# EAGLE design Main_PCB (EAGLE 9.6.2)
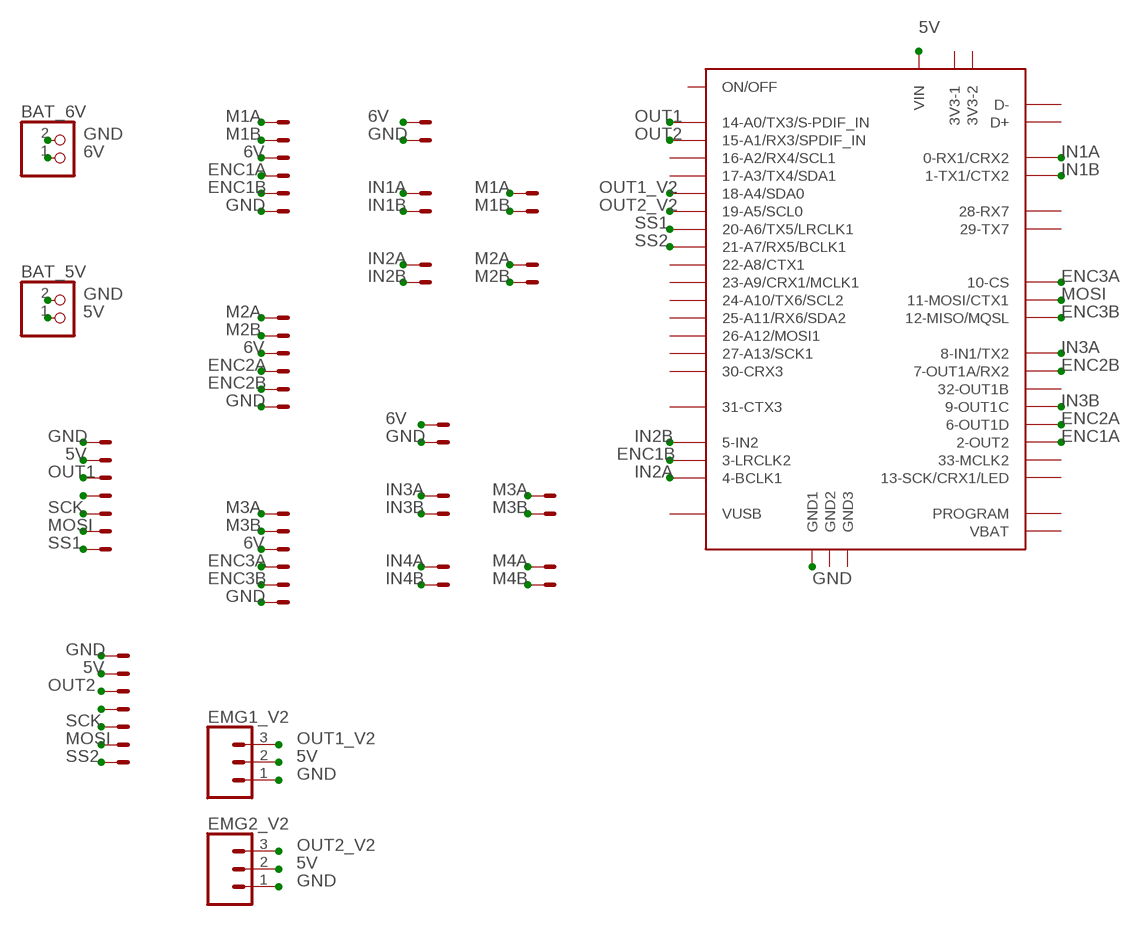
[diagram p0: schematic, sheet 1]

## Parts
BAT_5V  JST_2PIN-THM  [JST-PH-2-THM]
BAT_6V  JST_2PIN-THM  [JST-PH-2-THM]
EMG1  53047-07  [53047-07]
EMG1_V2  CONN_03  [1X03]
EMG2  53047-07  [53047-07]
EMG2_V2  CONN_03  [1X03]
JST-M1  22-23-2061  [22-23-2061]
JST-M2  22-23-2061  [22-23-2061]
JST-M3  22-23-2061  [22-23-2061]
MD1-IN1  22-23-2021  [22-23-2021]
MD1-IN2  22-23-2021  [22-23-2021]
MD1-M1  22-23-2021  [22-23-2021]
MD1-M2  22-23-2021  [22-23-2021]
MD1-PWR  22-23-2021  [22-23-2021]
MD2-IN3  22-23-2021  [22-23-2021]
MD2-IN4  22-23-2021  [22-23-2021]
MD2-M3  22-23-2021  [22-23-2021]
MD2-M4  22-23-2021  [22-23-2021]
MD2-PWR  22-23-2021  [22-23-2021]
U$1  TEENSY40  [TEENSY40]

## Nets
5V: BAT_5V.1 EMG1.2 EMG1_V2.2 EMG2.2 EMG2_V2.2 U$1.VIN
6V: BAT_6V.1 JST-M1.3 JST-M2.3 JST-M3.3 MD1-PWR.1 MD2-PWR.1
ENC1A: JST-M1.4 U$1.2-OUT2
ENC1B: JST-M1.5 U$1.3-LRCLK2
ENC2A: JST-M2.4 U$1.6-OUT1D
ENC2B: JST-M2.5 U$1.7-RX2/OUT1A(7-OUT1A/RX2)
ENC3A: JST-M3.4 U$1.10-CS/MQSR(10-CS)
ENC3B: JST-M3.5 U$1.12-MIO/MQSL(12-MISO/MQSL)
GND: BAT_5V.2 BAT_6V.2 EMG1.1 EMG1_V2.1 EMG2.1 EMG2_V2.1 JST-M1.6 JST-M2.6 JST-M3.6 MD1-PWR.2 MD2-PWR.2 U$1.GND1
IN1A: MD1-IN1.1 U$1.0-RX1(0-RX1/CRX2)
IN1B: MD1-IN1.2 U$1.1-TX1(1-TX1/CTX2)
IN2A: MD1-IN2.1 U$1.4-BCLK2(4-BCLK1)
IN2B: MD1-IN2.2 U$1.5-IN2
IN3A: MD2-IN3.1 U$1.8-TX2/IN1(8-IN1/TX2)
IN3B: MD2-IN3.2 U$1.9-OUT1C
IN4A: MD2-IN4.1
IN4B: MD2-IN4.2
M1A: JST-M1.1 MD1-M1.1
M1B: JST-M1.2 MD1-M1.2
M2A: JST-M2.1 MD1-M2.1
M2B: JST-M2.2 MD1-M2.2
M3A: JST-M3.1 MD2-M3.1
M3B: JST-M3.2 MD2-M3.2
M4A: MD2-M4.1
M4B: MD2-M4.2
MOSI: EMG1.6 EMG2.6 U$1.11-MOSI/CTX1
N$4: EMG1.4
N$11: EMG2.4
OUT1: EMG1.3 U$1.14-A0/TX3/S-PFI_OUT(14-A0/TX3/S-PDIF_IN)
OUT1_V2: EMG1_V2.3 U$1.18-A4/SDA0
OUT2: EMG2.3 U$1.15-A1/RX3/S-PDIF_IN(15-A1/RX3/SPDIF_IN)
OUT2_V2: EMG2_V2.3 U$1.19-A5/SCL0
SCK: EMG1.5 EMG2.5
SS1: EMG1.7 U$1.20-A6/TX5/LRCLK1
SS2: EMG2.7 U$1.21-A7/RX5/BCLK1
Unconnected: U$1.3V3-1 U$1.3V3-2 U$1.13-SCK/CRX1/LED U$1.16-A2/RX4/SCL1 U$1.17-A3/TX4/SDA1 U$1.22-A8/CTX1 U$1.23-A9/CRX1/CCLK1(23-A9/CRX1/MCLK1) U$1.24-A10/TX6/SCL2 U$1.25-A11/SDA2(25-A11/RX6/SDA2) U$1.26-A12/MOSI1 U$1.27-A13/SCK1 U$1.28-RX7 U$1.29-TX7 U$1.30-CRX3 U$1.31-CTX3 U$1.32-OUTB1(32-OUT1B) U$1.33-MCLK2 U$1.D+ U$1.D- U$1.GND2 U$1.GND3 U$1.ON/OFF U$1.PROGRAM U$1.VBAT U$1.VUSB

## Library data of the parts
BAT_5V BAT_6V = adafruit:JST_2PIN: JST 2-Pin Connectors of various flavors SMT-RA (S2B-PH-SM4) 4UConnector #17311 SMT (B2B-PH-SM4) THM-RA (S2B-PH) THM (B2B-PH)
EMG1 EMG2 = con-molex:53?-07: CONNECTOR wire to board 1.25 mm (.049 inch) pitch header; MF: MOLEX; MPN: 53047-0710-C; OC_FARNELL: 9732870; OC_NEWARK: 11M0149
EMG1_V2 EMG2_V2 = SparkFun-Connectors:CONN_03: Multi connection point. Often used as Generic Header-pin footprint for 0.1 inch spaced/style header connections On any of the 0.1 inch spaced packages, you can populate with these: Break Away Headers - Straight <https://www.sparkfun.com/products/116> (PRT-00116) Break Away Male Headers - Right Angle <https://www.sparkfun.com/products/553> (PRT-00553) Female Headers <https://www.sparkfun.com/products/115> (PRT-00115) Break Away Headers - Machine Pin <https://www.sparkfun.com/products/117> (PRT-00117) Break Away Female Headers - Swiss Machine Pin <https://www.sparkfun.com/products/743> (PRT-00743) Stackable Header - 3 Pin (Female, 0.1") <https://www.sparkfun.com/products/13875> (PRT-13875) For SCREWTERMINALS and SPRING TERMINALS visit here: Screw Terimnals on SparkFun.com <https://www.sparkfun.com/search/results?term=Screw+Terminals> (5mm/3.5mm/2.54mm spacing) This device is also useful as a general connection point to wire up your design to another part of your project. Our various solder wires solder well into these plated through hole pads. Hook-Up Wire - Assortment (Stranded, 22 AWG) <https://www.sparkfun.com/products/11375> (PRT-11375) Hook-Up Wire - Assortment (Solid Core, 22 AWG) <https://www.sparkfun.com/products/11367> (PRT-11367) View the entire wire category on our website here <https://www.sparkfun.com/categories/141> Special notes: Molex polarized connector foot print use with SKU : PRT-08232 with associated crimp pins and housings.
JST-M1-JST-M3 = con-molex:22-23-2061: .100" (2.54mm) Center Header - 6 Pin; MF: MOLEX; MPN: 22-23-2061; OC_FARNELL: 1462922; OC_NEWARK: 27C1933
MD1-IN1 MD1-IN2 MD1-M1 MD1-M2 MD1-PWR MD2-IN3 MD2-IN4 MD2-M3 MD2-M4 MD2-PWR = con-molex:22-23-2021: .100" (2.54mm) Center Header - 2 Pin; MF: MOLEX; MPN: 22-23-2021; OC_FARNELL: 1462926; OC_NEWARK: 25C3832
U$1 = teensy:TEENSY40: Teensy 4.0 device including POGO pins for pins 24 - 33, but not yet pins for D+ and D-. Symbol layout is what works for me and may not suite everyone... that can be added or additional symbols can be created to be used in a modilied davie name.

## Board
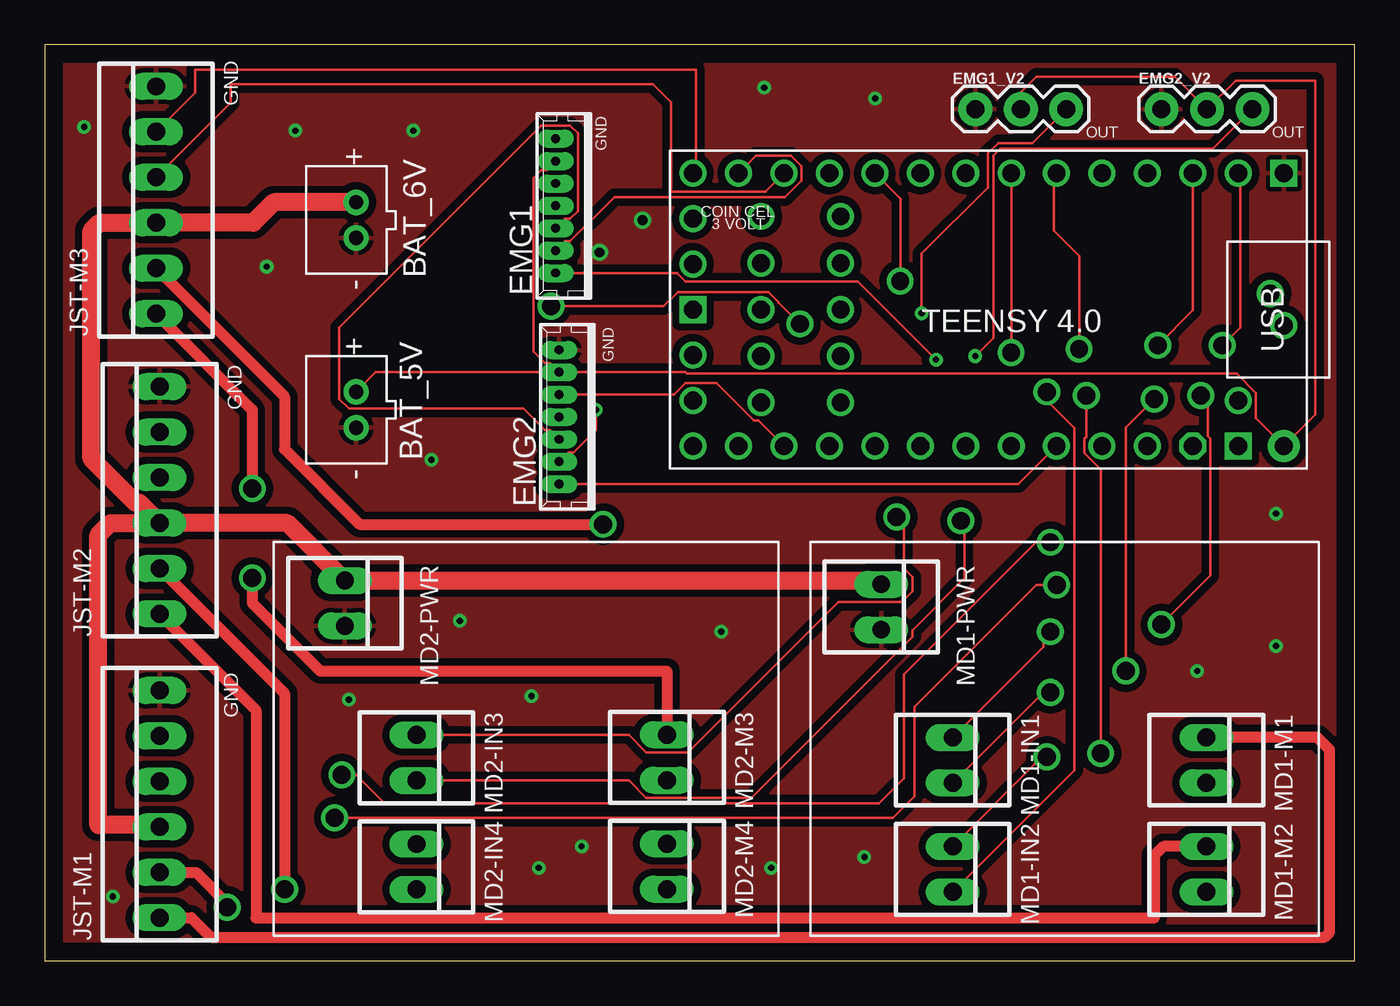
[diagram p1: board, top side]
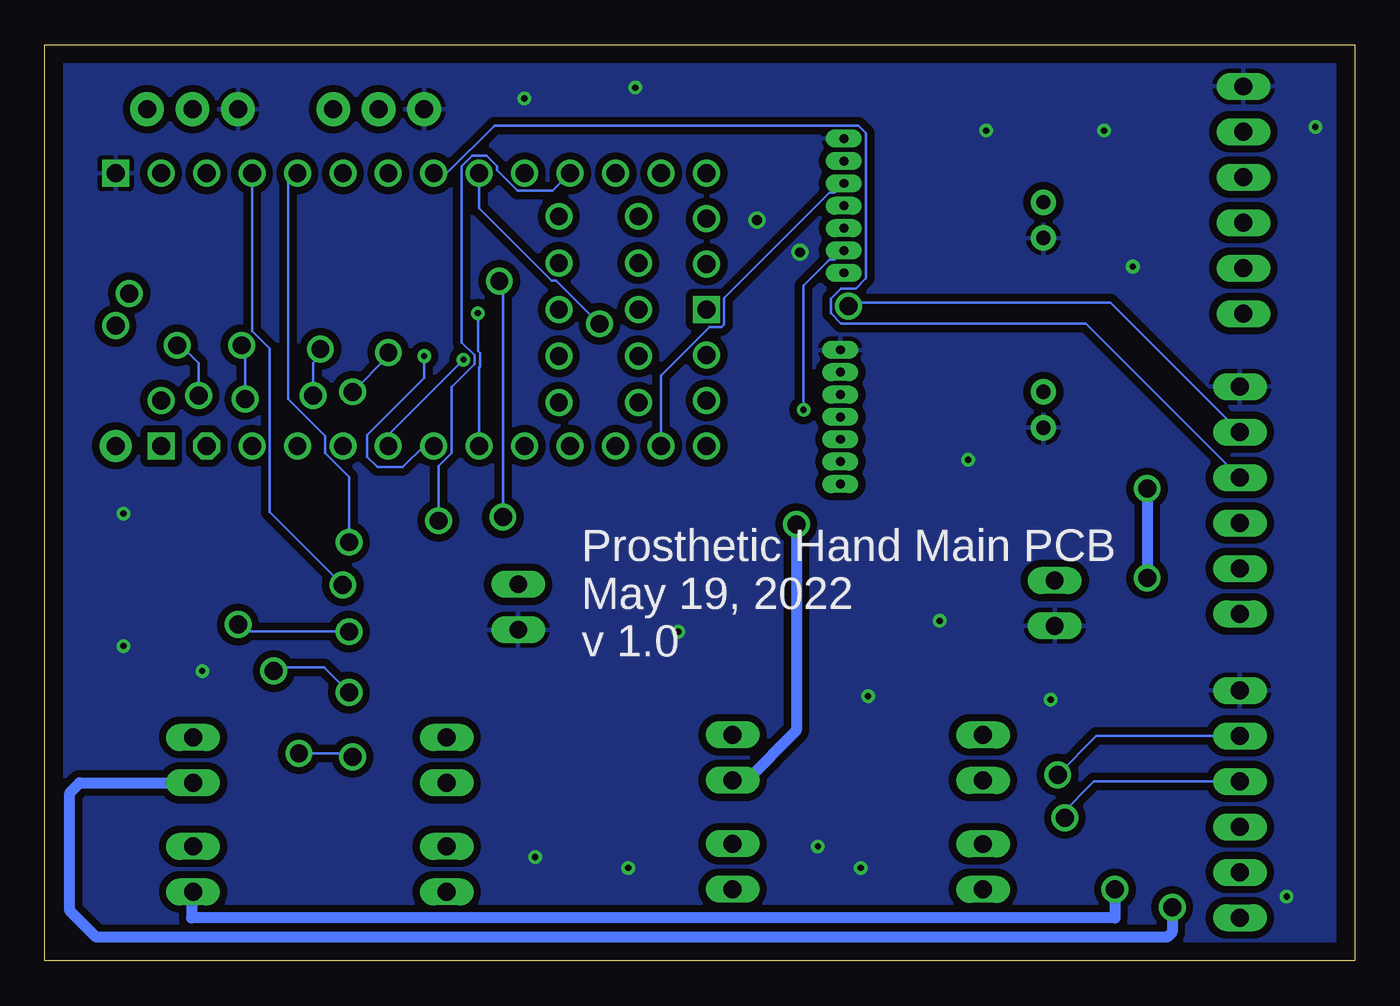
[diagram p2: board, bottom side, seen from below]

Size 73.2 x 51.2 mm. Coordinates in mm from the lower left corner, seen from the top.
Outline: 0,0 73.2,0 73.2,51.2 0,51.2 0,0
Copper layers (1*16): Top 0.035mm / dielectric 1.5mm / Bottom 0.035mm
Design rules "default": minimum track width 6mil, minimum drill 0.35mm, track to track 6mil, track to pad 6mil, pad to pad 6mil, via to via 6mil, smd to smd 6mil, copper to edge 40mil, drill to drill 6mil, minimum pad ring 10mil, minimum via ring 8mil, stop-mask expansion 4mil, vias tented up to drill 0mil, thermal gap 10mil

### Footprints (pad centres in the part's own frame; a part is rotated, then mirrored left to right if it is on the bottom)
JST-PH-2-THM = drill 0.8 pad 1.422: 1 1,0; 2 -1,0
53047-07 = drill 0.5 pad 0.698 long: 1 3.75,0.45; 2 2.5,0.45; 3 1.25,0.45; 4 0,0.45; 5 -1.25,0.45; 6 -2.5,0.45; 7 -3.75,0.45
1X03 = drill 1.016 pad 1.88: 1 0,0; 2 2.54,0; 3 5.08,0
22-23-2061 = drill 1 long: 1 -6.35,0; 2 -3.81,0; 3 -1.27,0; 4 1.27,0; 5 3.81,0; 6 6.35,0
22-23-2021 = drill 1 long: 1 -1.27,0; 2 1.27,0
TEENSY40 = drill 1: 0-RX1 -13.97,-7.62; 1-TX1 -11.43,-7.62; 2-OUT2 -8.89,-7.62; 3-LRCLK2 -6.35,-7.62; 3V3-2 16.51,-2.54; 4-BCLK2 -3.81,-7.62; 5-IN2 -1.27,-7.62; 6-OUT1D 1.27,-7.62; 7-RX2/OUT1A 3.81,-7.62; 8-TX2/IN1 6.35,-7.62; 9-OUT1C 8.89,-7.62; 10-CS/MQSR 11.43,-7.62; 11-MOSI/CTX1 13.97,-7.62; 12-MIO/MQSL 16.51,-7.62; 13-SCK/CRX1/LED 16.51,7.62; 14-A0/TX3/S-PFI_OUT 13.97,7.62; 15-A1/RX3/S-PDIF_IN 11.43,7.62; 16-A2/RX4/SCL1 8.89,7.62; 17-A3/TX4/SDA1 6.35,7.62; 18-A4/SDA0 3.81,7.62; 19-A5/SCL0 1.27,7.62; 20-A6/TX5/LRCLK1 -1.27,7.62; 21-A7/RX5/BCLK1 -3.81,7.62; 22-A8/CTX1 -6.35,7.62; 23-A9/CRX1/CCLK1 -8.89,7.62; 24-A10/TX6/SCL2 12.7,5.207; 25-A11/SDA2 8.255,5.207; 26-A12/MOSI1 12.7,2.603; 27-A13/SCK1 8.255,2.603; 28-RX7 12.7,0; 29-TX7 8.255,0; 30-CRX3 12.7,-2.603; 31-CTX3 8.255,-2.603; 32-OUTB1 12.7,-5.207; 33-MCLK2 8.255,-5.207; D+ -15.75,-0.9; D- -16.51,0.9; ON/OFF 16.51,5.08; PROGRAM 16.51,2.54; VBAT 16.51,-5.08; VUSB -13.97,5.08 | drill 1 octagon: 3V3-1 -11.43,7.62 | drill 1 square: GND1 -16.51,-7.62; GND2 16.51,0; GND3 -13.97,7.62 | drill 1 pad 1.778: VIN -16.51,7.62

### Placement (x,y rotation side)
BAT_5V  17.4,30.8 90 top
BAT_6V  17.4,41.4 90 top
EMG1  29,42.2 90 top
EMG1_V2  52,47.6 0 top
EMG2  29.2,30.4 90 top
EMG2_V2  62.4,47.6 0 top
JST-M1  6.42,8.76 90 top
JST-M2  6.42,25.74 90 top
JST-M3  6.22,42.52 90 top
MD1-IN1  50.74,11.22 270 top
MD1-IN2  50.74,5.13 270 top
MD1-M1  64.91,11.22 270 top
MD1-M2  64.91,5.13 270 top
MD1-PWR  46.74,19.78 270 top
MD2-IN3  20.77,11.35 270 top
MD2-IN4  20.77,5.26 270 top
MD2-M3  34.77,11.37 270 top
MD2-M4  34.77,5.28 270 top
MD2-PWR  16.77,19.99 270 top
U$1  52.73,36.4 180 top

### Tracks (layer width: path | path; a pad name or v marks a point on that pad's centre or on a via)
5V
  Top 0.152: EMG1.2 28.03,44.18 27.74,44.18 27.31,43.75 27.31,34.05 27.94,33.42 28.23,33.42 EMG2.2 | BAT_5V.1 18.5,32.9 EMG2.2 | EMG2.2 35.79,32.9 35.88,32.81 66.6,32.81 67.68,31.73 67.68,30.34 U$1.VIN 71,30.54 71,49.2 66.54,49.2 EMG2_V2.2 63.14,49.4 55.4,49.4 54.54,48.54 EMG1_V2.2
6V
  Top 1.016: BAT_6V.1 12.8,42.4 11.65,41.25 JST-M3.3 3.05,41.25 2.6,40.8 2.6,28.08 5.08,25.6 5.29,25.6 JST-M2.3 | JST-M2.3 13.56,24.47 MD2-PWR.1 46.53,21.26 MD1-PWR.1 | JST-M1.3 6.31,7.6 3,7.6 3,23.8 3.67,24.47 JST-M2.3
ENC1A  (via drill 1)
  Top 0.152: v16.2,8 47.4,8 48.6,9.2 48.6,14.2 55.4,21 v56.54,21 56.4,21
  Bottom 0.152: JST-M1.4 14.57,10.03 16.4,8.2 v16.2,8 | U$1.2-OUT2 61.62,35.2 60.64,34.22 60.64,25.09 v56.54,21
ENC1B  (via drill 1)
  Top 0.152: v16.6,10.4 17.4,10.4 19,8.8 46.6,8.8 48,10.2 48,16 55.4,23.4 v56.2,23.4
  Bottom 0.152: JST-M1.5 14.43,12.57 v16.6,10.4 | v56.2,23.4 56.2,27.05 57.52,28.37 57.52,29.32 59.6,31.4 59.6,43.5 U$1.3-LRCLK2
ENC2A
  Bottom 0.152: U$1.6-OUT1D 50.74,44.02 48.08,46.68 27.74,46.68 27.31,46.25 27.31,38.15 27.88,37.58 28.7,37.58 29.27,37.01 29.27,36.2 28.7,35.62 15.03,35.62 JST-M2.4
ENC2B  (via drill 1)
  Top 0.152: v28.29,36.6 34.59,36.6 35.37,37.38 40.44,37.38 41.01,36.81 41.01,36.79 v42.2,35.6
  Bottom 0.152: JST-M2.5 13.67,36.8 28.09,36.8 v28.29,36.6 | v42.2,35.6 44.62,38.02 44.88,38.02 48.92,42.06 U$1.7-RX2/OUT1A
ENC3A
  Top 0.152: JST-M3.4 10.4,47.97 10.4,49 34,49 35,48 35,43 40.28,43 U$1.10-CS/MQSR
ENC3B
  Top 0.152: JST-M3.5 8.4,48.51 8.4,49.8 36.4,49.8 36.4,44.2 U$1.12-MIO/MQSL
GND  (via drill 0.35, 0.55)
  other vias: 33.4,41.4 31,39.6 2.2,46.6 14,46.4 20.6,46.4 12.4,38.8 40.2,48.8 46.4,48.2 21.6,28 23.2,19 37.8,18.4 27.2,14.8 17,14.6 3.8,3.6 27.6,5.2 30,6.4 40.6,5.2 45.8,5.8 68.8,25 64.4,16.2 68.8,17.6
  pour Bottom (isolate 0.406): 0,0 0,51.2 73,51.2 73.2,51 73.2,-0.2 0.2,-0.2
  pour Top (isolate 0.406): 0,51.2 73.2,51.2 73.2,0 0,0
IN1A  (via drill 1)
  Top 0.152: MD1-IN1.1 55.8,17.55 55.8,18.4 v56.2,18.4 | v62.4,18.8 65.14,21.54 65.14,29.19 65,29.33 65,31.6 v64.6,31.6 | v65.8,34.4 66.8,35.4 66.8,43.92 U$1.0-RX1
  Bottom 0.152: v56.2,18.4 62,18.4 v62.4,18.8 | v64.6,31.6 64.6,33.4 65.6,34.4 v65.8,34.4
IN1B  (via drill 1)
  Top 0.152: MD1-IN1.2 55.79,15 v56.2,15 | v60.4,16.2 60.4,29.8 v62,31.4 | v62.2,34.4 64.16,36.36 U$1.1-TX1
  Bottom 0.152: v56.2,15 57.6,16.4 60.2,16.4 v60.4,16.2 | v62,31.4 62,33.8 62.2,34 v62.2,34.4
IN2A  (via drill 1)
  Top 0.152: MD1-IN2.1 55.34,11 56,11 v56,11.4 | v59,11.6 59,27.47 58.1,28.37 58.1,29.19 58.2,29.29 v58.2,31.6 | v57.8,34.2 57.8,39.4 56.4,40.8 56.4,43.88 U$1.4-BCLK2
  Bottom 0.152: v56,11.4 56.2,11.6 v59,11.6 | v58.2,31.6 58.2,33.4 57.8,33.8 v57.8,34.2
IN2B  (via drill 1)
  Top 0.152: v56,31.8 56,31.31 57.52,29.79 57.52,10.64 MD1-IN2.2 | v54,34 U$1.5-IN2
  Bottom 0.152: v56,31.8 54,33.8 v54,34
IN3A  (via drill 1)
  Top 0.152: MD2-IN3.1 32.65,12.62 33.61,11.66 35.93,11.66 44.34,20.07 47.9,20.07 48.48,20.64 48.48,21.46 48,21.93 48,24.8 v47.6,24.8 | v47.8,38 47.8,42.6 U$1.8-TX2/IN1
  Bottom 0.152: v47.6,24.8 47.6,37.8 v47.8,38
IN3B  (via drill 1)
  Top 0.152: MD2-IN3.2 32.65,10.08 33.61,9.12 39.49,9.12 48.48,18.1 48.48,18.48 51.4,21.4 51.4,24.4 v51.2,24.6
  Bottom 0.152: v51.2,24.6 51.2,27.65 50.48,28.37 50.48,32.06 49.19,33.35 49.19,33.85 49.9,34.56 49.9,44.43 49.33,45 48.51,45 47.94,44.43 47.94,44.19 46.79,43.04 44.82,43.04 U$1.9-OUT1C
M1A
  Top 0.61: JST-M1.1 8.19,2.41 9.28,1.32 71.52,1.32 71.8,1.6 71.8,11.8 71.11,12.49 MD1-M1.1
M1B  (via drill 1)
  Top 0.61: JST-M1.2 8.45,4.95 10.2,3.2 v10.2,3
  Bottom 0.61: v10.2,3 10.2,1.6 10.48,1.32 70.32,1.32 71.8,2.8 71.8,9.4 71.25,9.95 MD1-M1.2
M2A
  Top 0.61: JST-M2.1 11.8,14.01 11.8,2.4 62,2.4 62,5.89 62.51,6.4 MD1-M2.1
M2B  (via drill 1)
  Top 0.61: JST-M2.2 13.4,14.95 v13.4,4
  Bottom 0.61: v13.4,4 13.4,2.4 65,2.4 65,3.77 MD1-M2.2
M3A  (via drill 1)
  Top 0.61: JST-M3.1 11.6,30.79 v11.6,26.4 | v11.6,21.4 11.6,20 15.4,16.2 34.77,16.2 MD2-M3.1
  Bottom 0.61: v11.6,26.4 v11.6,21.4
M3B  (via drill 1)
  Top 0.61: JST-M3.2 13.4,31.53 13.4,28.6 17.6,24.4 v31.2,24.4
  Bottom 0.61: v31.2,24.4 31.2,12.87 33.97,10.1 MD2-M3.2
MOSI  (via drill 0.35)
  Top 0.152: EMG1.6 29.07,40.22 29.36,40.22 31.84,42.7 41.37,42.7 42.28,43.61 42.28,44.43 41.71,45 39.74,45 U$1.11-MOSI/CTX1 | EMG2.6 29.27,28.42 29.56,28.42 30.8,29.66 v30.8,30.8
  Bottom 0.152: EMG1.6 29.07,39.18 29.36,39.18 30.8,37.74 v30.8,30.8
OUT1
  Bottom 0.152: EMG1.3 29.07,42.93 29.36,42.93 35.24,37.05 35.24,35.55 35.37,35.42 36.05,35.42 38.76,32.71 U$1.14-A0/TX3/S-PFI_OUT
OUT1_V2  (via drill 0.35)
  Top 0.152: v49,36.2 49,39.52 52.7,43.22 52.7,45.13 53.27,45.7 55.19,45.7 EMG1_V2.3
  Bottom 0.152: v49,36.2 49,34.09 48.89,33.98 48.89,33.22 48.92,33.19 U$1.18-A4/SDA0
OUT2
  Top 0.152: U$1.15-A1/RX3/S-PDIF_IN 39.87,30.21 39.62,30.21 37.53,32.3 35.81,32.3 35.16,31.65 EMG2.3
OUT2_V2  (via drill 0.35)
  Top 0.152: EMG2_V2.3 65.28,45.4 53.4,45.4 53,45 53,34.8 v52,33.8
  Bottom 0.152: v52,33.8 52,32.57 55.18,29.39 55.18,28.17 54.61,27.6 53.19,27.6 52.01,28.78 U$1.19-A5/SCL0
SCK
  Top 0.152: EMG2.5 28.23,29.67 27.94,29.67 26.75,30.86 17.01,30.86 16.46,31.41 16.46,35.4 27.74,46.68 29.36,46.68 29.79,46.25 29.79,41.9 29.36,41.47 29.07,41.47 EMG1.5
SS1  (via drill 0.35)
  Top 0.152: EMG1.7 35.32,38.45 35.81,37.96 45.44,37.96 v49.8,33.6
  Bottom 0.152: v49.8,33.6 54,29.4 U$1.20-A6/TX5/LRCLK1
SS2
  Top 0.152: EMG2.7 54.41,26.65 U$1.21-A7/RX5/BCLK1

### Text on the board
tPlace: GND | GND | OUT | OUT | GND | GND | GND
bPlace: Prosthetic Hand Main PCB / May 19, 2022 / v 1.0